# Altium schematic sheet MotorCell_2.SchDoc
size A3
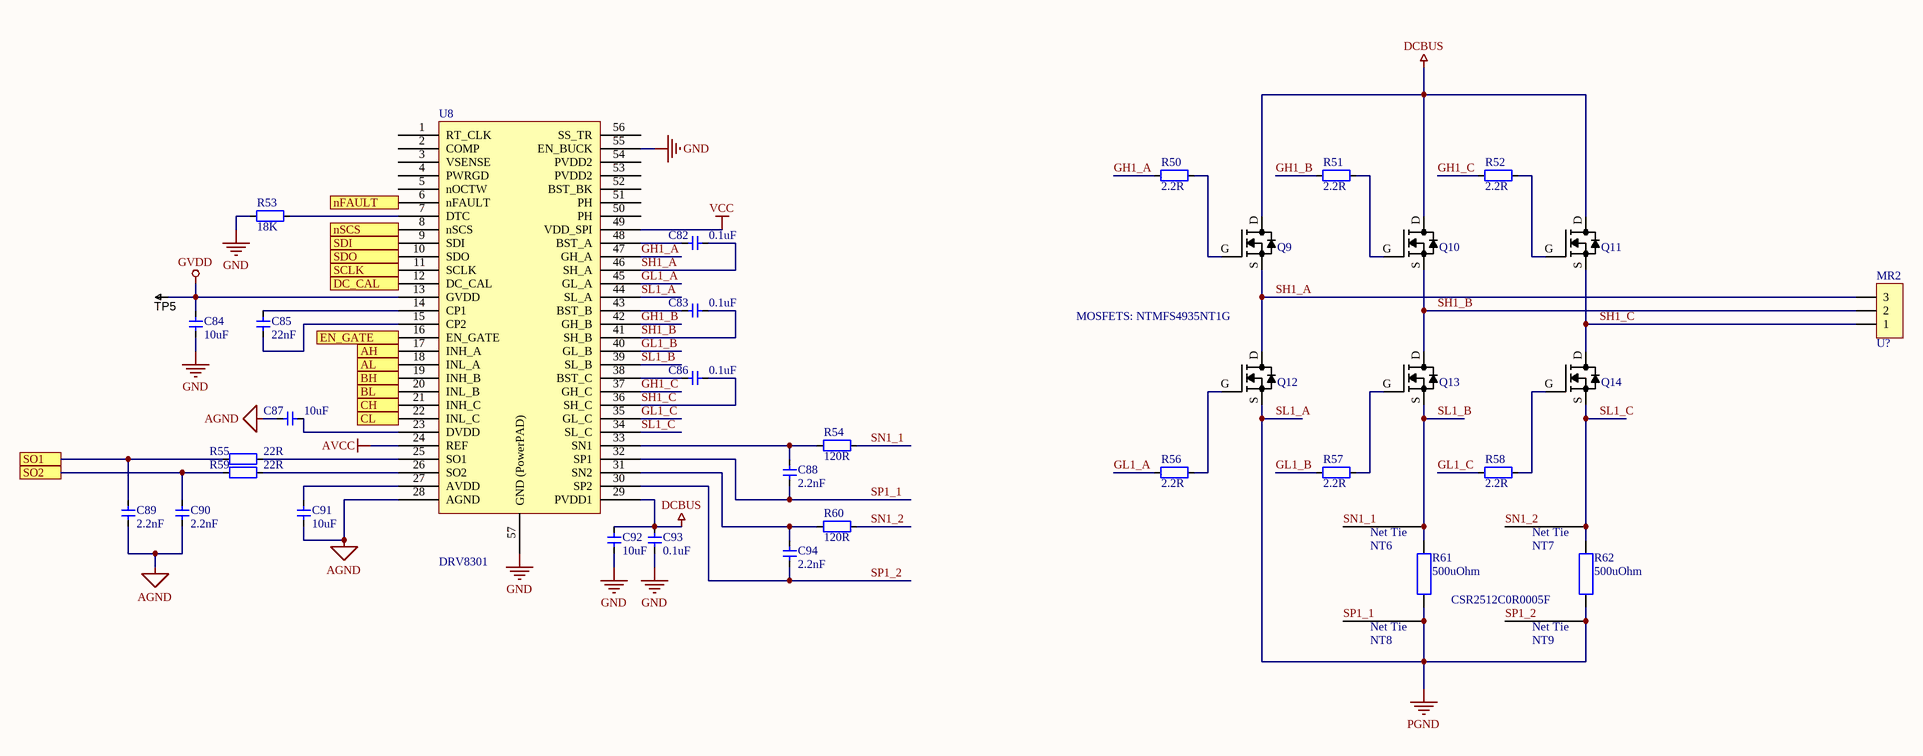
[diagram p0: MotorCell_2.SchDoc]

## Parts
C82  0.1uF  [CAP_0603]
C83  0.1uF  [CAP_0603]
C84  10uF  [CAP_0402]
C85  22nF  [CAP_0402]
C86  0.1uF  [CAP_0603]
C87  10uF  [CAP_0402]
C88  2.2nF  [CAP_0402]
C89  2.2nF  [CAP_0402]
C90  2.2nF  [CAP_0402]
C91  10uF  [CAP_0402]
C92  10uF  [CAP_0603]
C93  0.1uF  [CAP_0603]
C94  2.2nF  [CAP_0402]
MR2  U?  [MR30PW-M]
NT6  0.25mm  [NetTie_0.25mm]  (value not drawn)  (net tie, no BOM)
NT7  0.25mm  [NetTie_0.25mm]  (value not drawn)  (net tie, no BOM)
NT8  0.25mm  [NetTie_0.25mm]  (value not drawn)  (net tie, no BOM)
NT9  0.25mm  [NetTie_0.25mm]  (value not drawn)  (net tie, no BOM)
Q9  NTMFS4935NT1G  [SO8FL]  (value not drawn)
Q10  NTMFS4935NT1G  [SO8FL]  (value not drawn)
Q11  NTMFS4935NT1G  [SO8FL]  (value not drawn)
Q12  NTMFS4935NT1G  [SO8FL]  (value not drawn)
Q13  NTMFS4935NT1G  [SO8FL]  (value not drawn)
Q14  NTMFS4935NT1G  [SO8FL]  (value not drawn)
R50  2.2R  [RES_0402]
R51  2.2R  [RES_0402]
R52  2.2R  [RES_0402]
R53  18K  [RES_0402]
R54  120R  [RES_0402]
R55  22R  [RES_0402]
R56  2.2R  [RES_0402]
R57  2.2R  [RES_0402]
R58  2.2R  [RES_0402]
R59  22R  [RES_0402]
R60  120R  [RES_0402]
R61  value 500uOhm  [RESC6432X09N]  (hidden comment: CSR2512C0R0005F)
R62  value 500uOhm  [RESC6432X09N]  (hidden comment: CSR2512C0R0005F)
TP5  TESTPOINT  [TP-R30]  (value not drawn)  (no BOM)
U8  DRV8301  [TSSOP50P810X120_HS-57N]

## Ports
AH, AL, BH, BL, CH, CL, DC_CAL, EN_GATE, nFAULT, nSCS, SCLK, SDI, SDO, SO1, SO2

## Nets
AGND: C87.2 C89.1 C90.1 C91.1 U8.28(AGND)
AVCC: U8.24(REF)
DCBUS: C92.2 C93.2 Q9.D Q10.D Q11.D U8.29(PVDD1)
GND: C84.1 C92.1 C93.1 R53.1 U8.55(EN_BUCK) U8.57(GND_(PowerPAD))
GVDD: C84.2 TP5.1 U8.13(GVDD)
SL1_A: NT8.2 NT9.2 Q12.S R61.1 R62.1 U8.44(SL_A)  [also labelled PGND]
VCC: U8.49(VDD_SPI)
AH: U8.17(INH_A) ; port AH
AL: U8.18(INL_A) ; port AL
BH: U8.19(INH_B) ; port BH
BL: U8.20(INL_B) ; port BL
CH: U8.21(INH_C) ; port CH
CL: U8.22(INL_C) ; port CL
DC_CAL: U8.12(DC_CAL) ; port DC_CAL
EN_GATE: U8.16(EN_GATE) ; port EN_GATE
GH1_A: R50.1 U8.47(GH_A)
GH1_B: R51.1 U8.42(GH_B)
GH1_C: R52.1 U8.37(GH_C)
GL1_A: R56.1 U8.45(GL_A)
GL1_B: R57.1 U8.40(GL_B)
GL1_C: R58.1 U8.35(GL_C)
nFAULT: U8.6(nFAULT) ; port nFAULT
nSCS: U8.8(nSCS) ; port nSCS
SCLK: U8.11(SCLK) ; port SCLK
SDI: U8.9(SDI) ; port SDI
SDO: U8.10(SDO) ; port SDO
SH1_A: C82.2 MR2.3 Q9.S Q12.D U8.46(SH_A)
SH1_B: C83.2 MR2.2 Q10.S Q13.D U8.41(SH_B)
SH1_C: C86.2 MR2.1 Q11.S Q14.D U8.36(SH_C)
SL1_B: NT6.2 Q13.S R61.2 U8.39(SL_B)
SL1_C: NT7.2 Q14.S R62.2 U8.34(SL_C)
SN1_1: NT6.1 R54.2
SN1_2: NT7.1 R60.2
SO1: C89.2 R55.1 ; port SO1
SO2: C90.2 R59.1 ; port SO2
SP1_1: C88.1 NT8.1 U8.32(SP1)
SP1_2: C94.1 NT9.1 U8.30(SP2)
NetC82_1: C82.1 U8.48(BST_A)
NetC83_1: C83.1 U8.43(BST_B)
NetC85_1: C85.1 U8.14(CP1)
NetC85_2: C85.2 U8.15(CP2)
NetC86_1: C86.1 U8.38(BST_C)
NetC87_1: C87.1 U8.23(DVDD)
NetC88_2: C88.2 R54.1 U8.33(SN1)
NetC91_2: C91.2 U8.27(AVDD)
NetC94_2: C94.2 R60.1 U8.31(SN2)
NetQ9_G: Q9.G R50.2
NetQ10_G: Q10.G R51.2
NetQ11_G: Q11.G R52.2
NetQ12_G: Q12.G R56.2
NetQ13_G: Q13.G R57.2
NetQ14_G: Q14.G R58.2
NetR53_2: R53.2 U8.7(DTC)
NetR55_2: R55.2 U8.25(SO1)
NetR59_2: R59.2 U8.26(SO2)

Not connected (* = marked no-connect by the designer): U8 1(RT_CLK) 2(COMP) 3(VSENSE) 4(PWRGD) 5(nOCTW) 50(PH) 51(PH) 52(BST_BK) 53(PVDD2) 54(PVDD2) 56(SS_TR)

## Notes on the sheet
- MOSFETS: NTMFS4935NT1G
- (near NT9) CSR2512C0R0005F
- (in symbol NetTie_0.25mm) Net Tie

## Library data of the parts
C82 C83 C86 C92 C93 = 电容-0603: Capacitor; Value: 0.1u
C84 C85 C87-C91 C94 = 电容-0402: Capacitor; Value: 0.1u
MR2 = MR30PW-M: MR30PW-M 三芯
NT6-NT9 = NetTie_0.25mm
Q9-Q14 = NTMFS4935NT1G: MOSFET N-CH 30V 13A SO8FL; Manufacturer: ON Semiconductor; FET Type: N-Channel; Current - Continuous Drain (Id) @ 25°C: 13A (Ta), 93A (Tc); Drive Voltage (Max Rds On,  Min Rds On): 4.5V, 10V; Vgs(th) (Max) @ Id: 2.2V @ 250µA; Gate Charge (Qg) (Max) @ Vgs: 49.4nC @ 10V; Input Capacitance (Ciss) (Max) @ Vds: 4850pF @ 15V; Vgs (Max): ±20V; Power Dissipation (Max): 930mW (Ta), 48W (Tc); Rds On (Max) @ Id, Vgs: 3.2 mOhm @ 30A, 10V; Supplier 1: Digi-Key; Supplier Part Number 1: NTMFS4935NT1GOSCT-ND; RoHS: RoHS Compliant; Category: Discrete Semiconductor Products; Stock 1: 932; Pricing 1: 1=0.61, 10=0.541, 100=0.4145, 500=0.3277 (USD); Packaging: Cut Tape (CT); Part Status: Active; Technology: MOSFET (Metal Oxide); Drain to Source Voltage (Vdss): 30V; FET Feature: -; Operating Temperature: -55°C ~ 150°C (TJ); Mounting Type: Surface Mount; Supplier Device Package: 5-DFN (5x6) (8-SOFL); Package / Case: 8-PowerTDFN, 5 Leads; ComponentLink1URL: http://www.onsemi.com/pub_link/Collateral/NTMFS4935N-D.PDF; ComponentLink1Description: http://www.onsemi.com/pub_link/Collateral/NTMFS4935N-D.PDF; Manufacturer Part Number: NTMFS4935NT1G
R50-R54 R56-R58 R60 = 电阻-0402: Resistor; Value: 22R
R55 R59 = 电阻-0402: Resistor; Value: 22R
R61 R62 = CSR2512C0R0005F: RES SMD 0.0005 OHM 1% 3W 2512; Manufacturer: Riedon; Temperature Coefficient: ±100ppm/°C; Supplier 1: Digi-Key; Supplier Part Number 1: 696-1183-2-ND; RoHS: RoHS Compliant; Category: Resistors; Stock: 2000; Pricing 1: 2000=0.19817, 6000=0.1937, 10000=0.187, 50000=0.18148 (USD); Packaging: Tape & Reel (TR); Part Status: Active; Tolerance: ±1%; Power (Watts): 3W; Composition: Metal Element; Features: Current Sense; Operating Temperature: -55°C ~ 170°C; Package / Case: 2512 (6432 Metric); Supplier Device Package: 2512; Size / Dimension: 0.250" L x 0.118" W (6.35mm x 3.00mm); Height - Seated (Max): 0.057" (1.45mm); Failure Rate: -; ComponentLink1URL: http://riedon.com/media/pdf/CSR.pdf; ComponentLink1Description: http://riedon.com/media/pdf/CSR.pdf; Supplier 2: Digi-Key; Supplier Part Number 2: 696-1183-1-ND; Pricing 2: 1=0.69, 10=0.574, 25=0.4916, 50=0.4426, 100=0.3852, 250=0.3442, 500=0.27864, 1000=0.22536 (USD); Manufacturer Part Number: CSR2512C0R0005F
TP5 = TESTPOINT: SMD test pin
U8 = DRV8301: MOTOR DRIVER, 3PH, 56HTSSOP